# EAGLE design to_manufacturer_board (EAGLE 5.11)
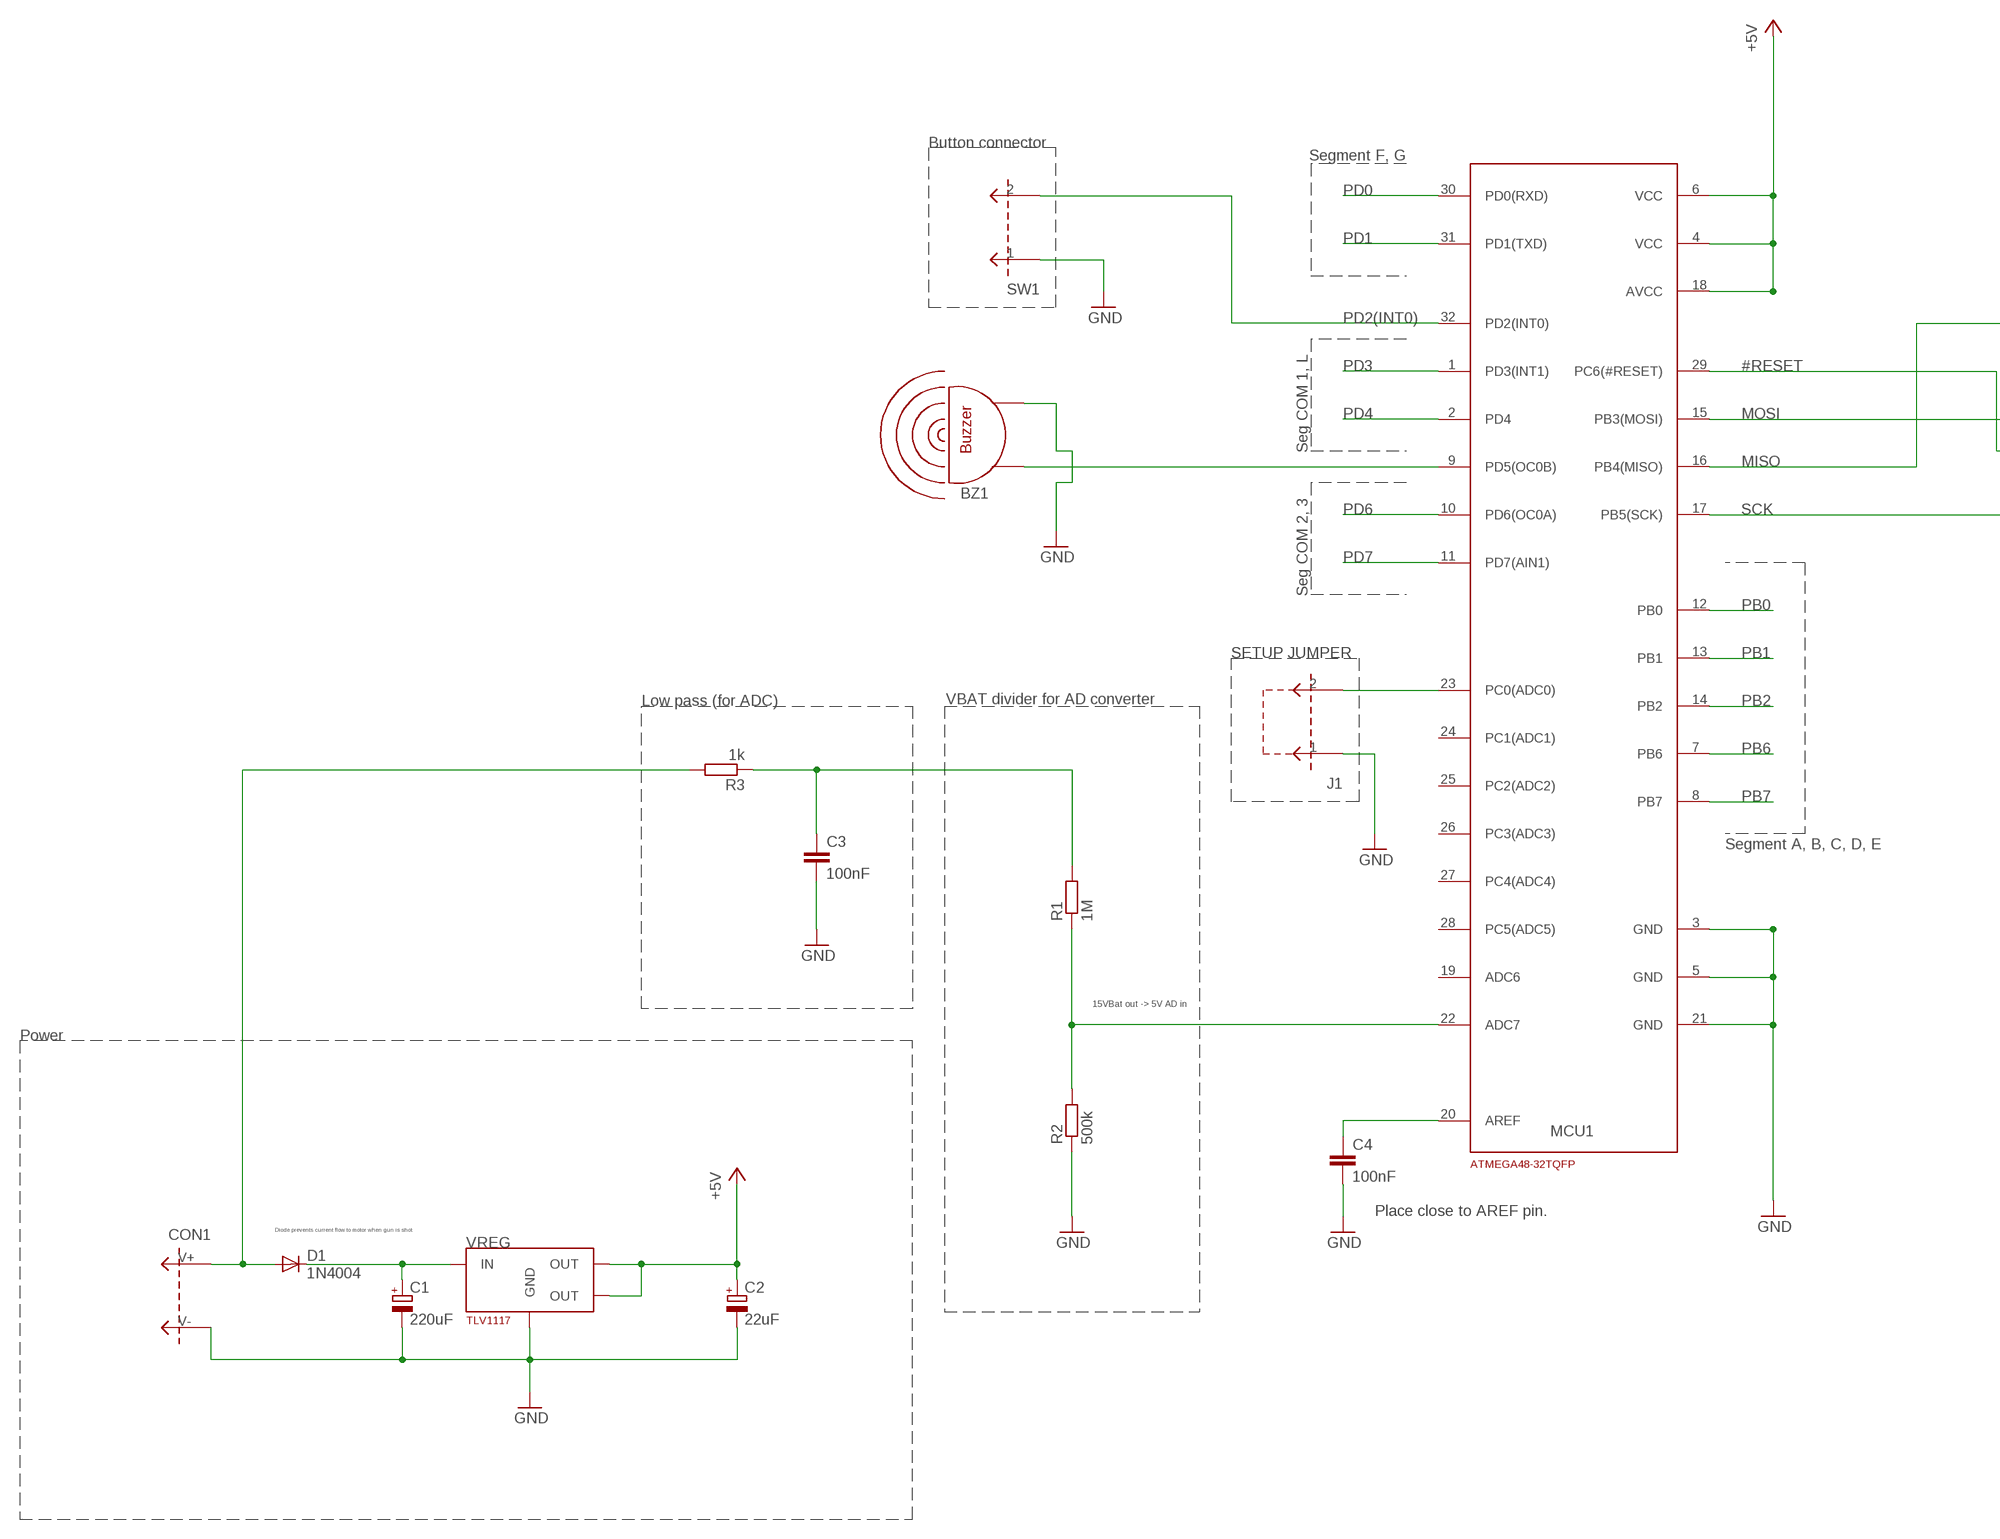
[diagram p0: schematic, sheet 1, part 1 of 2]
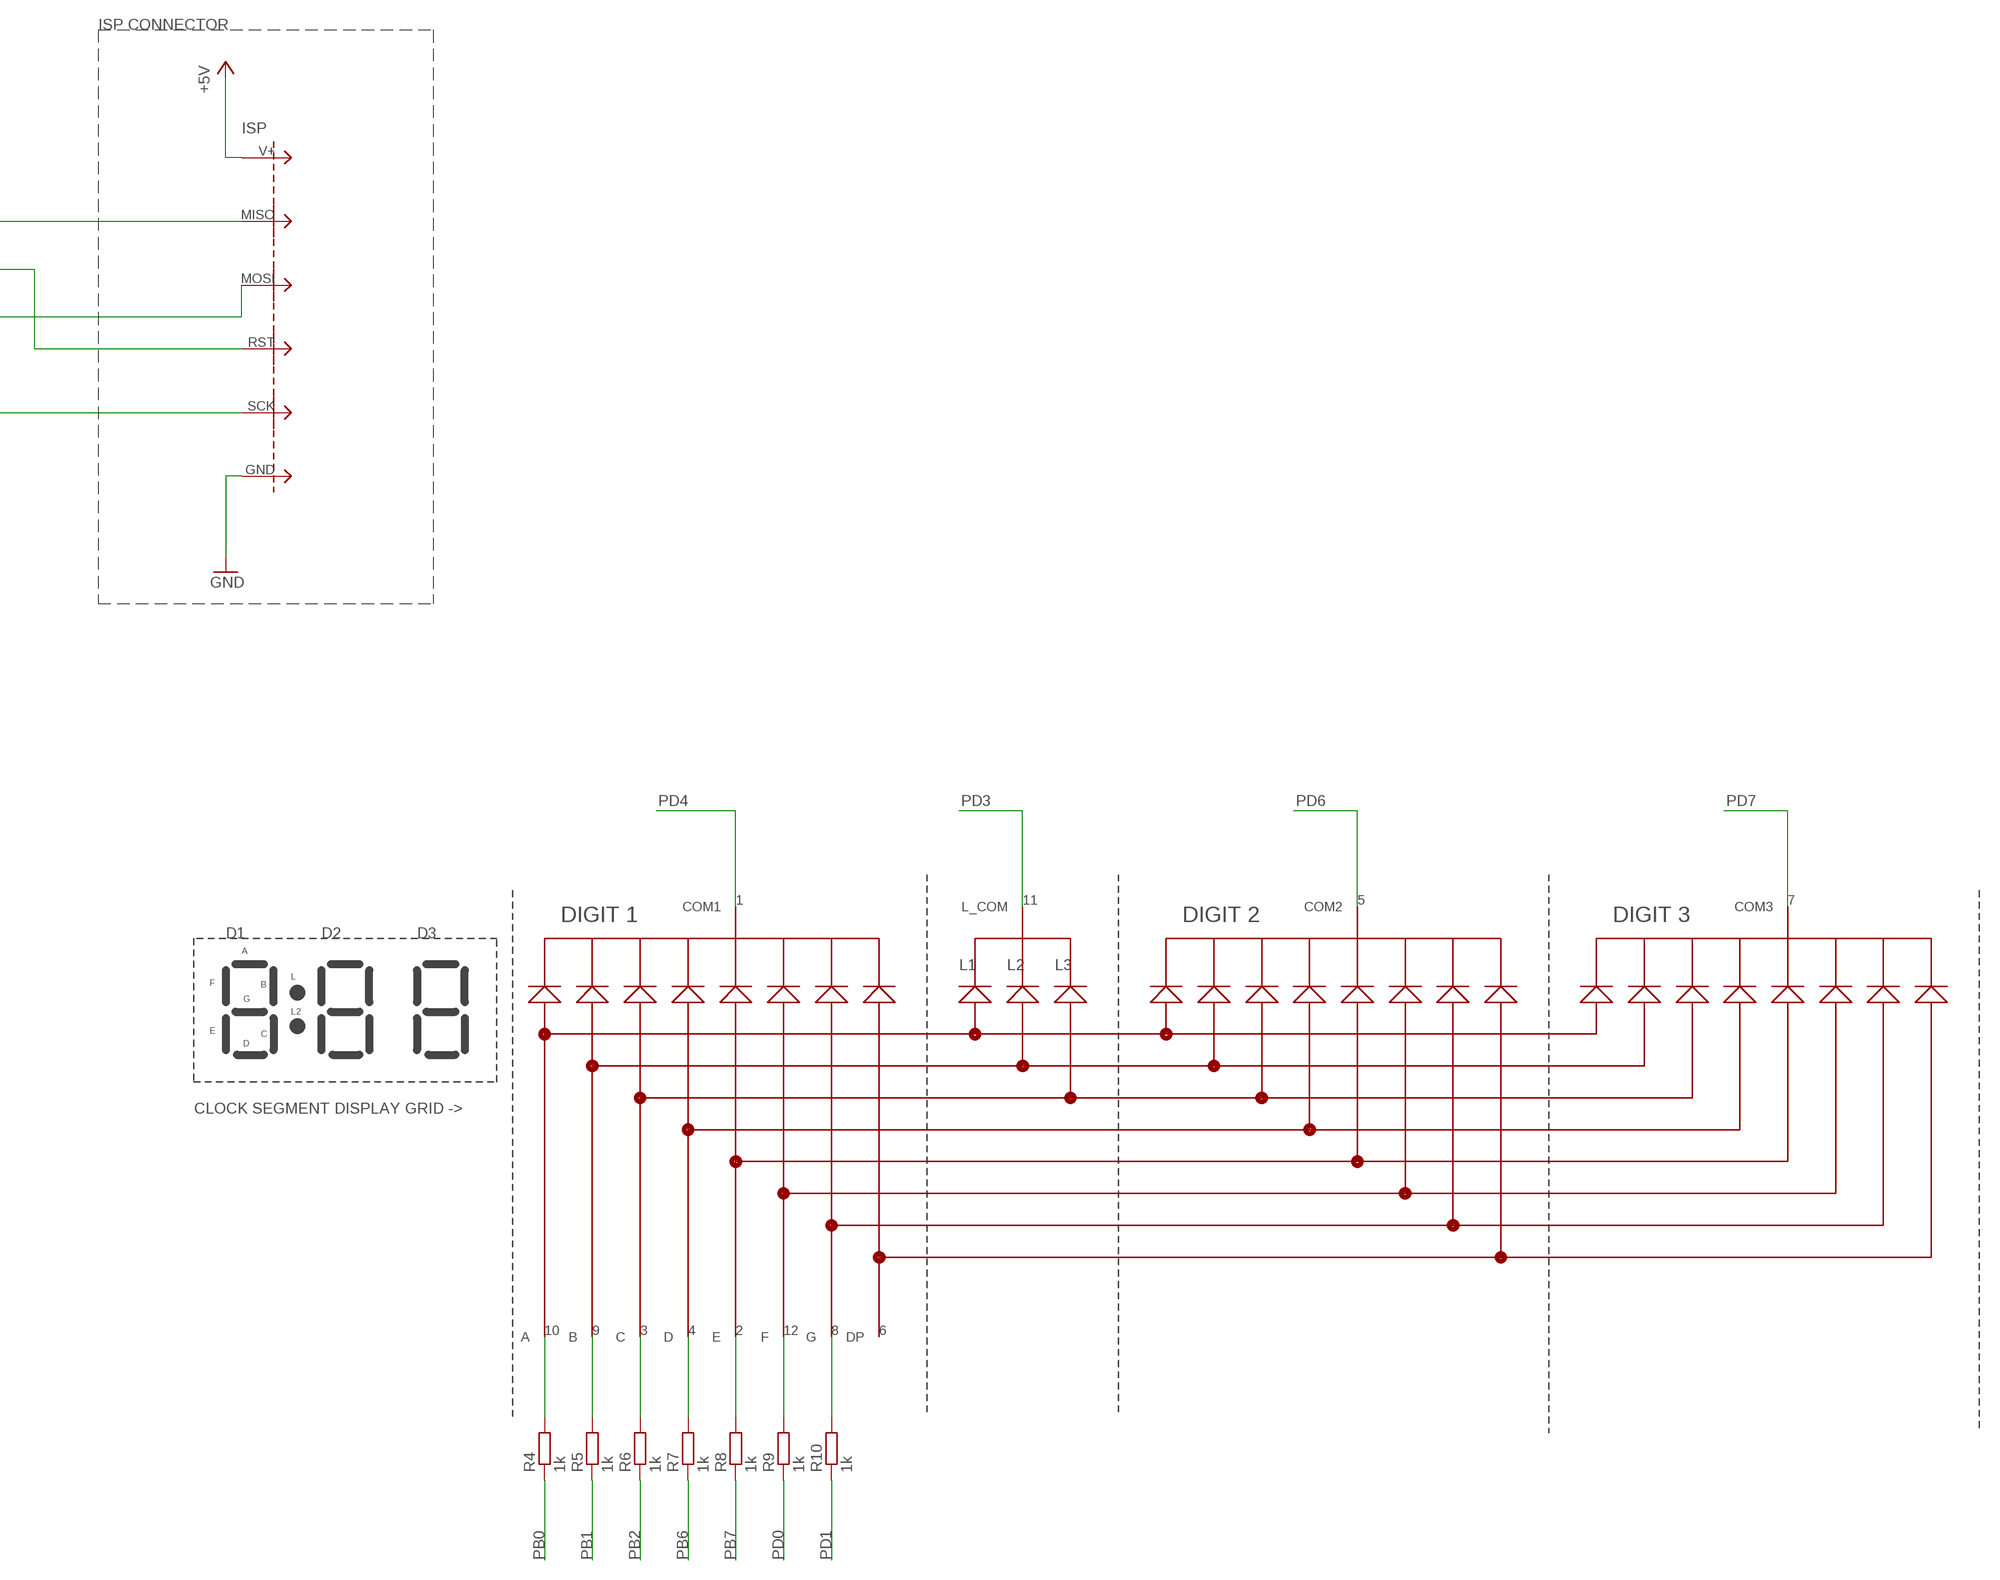
[diagram p1: schematic, sheet 1, part 2 of 2]

## Parts
BZ1  PS1720P02_BUZZER  [PS1720P02_BUZZER]
C1  220uF  CPOL-EUE3.5-8  [E3,5-8]
C2  22uF  CPOL-EUE1.5-5  [E1.5-5]
C3  100nF  C-EUC1206  [C1206]
C4  100nF  C-EUC1206  [C1206]
CON1  CONNECTOR_2PIN1X2_POWER_WIRE  [1X2_POWER_WIRE]
D1  1N4004  [DO41-10]
ISP  CONNECTOR_6PIN2X3_ISP  [2X3_ISP]
J1  CONNECTOR_2PIN1X2  [1X2_GENERIC]
MCU1  ATMEGA48-20PU-32TQFP  ATMEGA48-20PU-32TQFPTQFP32  [TQFP32-08]
R1  1M  R-EU_R0805  [R0805]
R2  500k  R-EU_R0805  [R0805]
R3  1k  R-EU_R0805  [R0805]
R4  1k  R-EU_R0805  [R0805]
R5  1k  R-EU_R0805  [R0805]
R6  1k  R-EU_R0805  [R0805]
R7  1k  R-EU_R0805  [R0805]
R8  1k  R-EU_R0805  [R0805]
R9  1k  R-EU_R0805  [R0805]
R10  1k  R-EU_R0805  [R0805]
SEGMENT1  SEGMENT_CLOCK_MODULE_3_DIGIT_COMMON_CATHODE  [SEGMENT_CLOCK_DISPLAY_HDSP_433G]
SW1  CONNECTOR_2PIN1X2  [1X2_GENERIC]
VREG  5VREG_TLV1117  [SOT223]

## Nets
#RESET: ISP.RST MCU1.29(PC6(#RESET))
+5V: C2.+ ISP.V+ MCU1.4(VCC) MCU1.6(VCC) MCU1.18(AVCC) VREG.2(OUT) VREG.4(OUT)
GND: BZ1.P$2 C1.- C2.- C3.2 C4.2 CON1.V- ISP.GND J1.1 MCU1.3(GND) MCU1.5(GND) MCU1.21(GND) R2.1 SW1.1 VREG.1(GND)
MISO: ISP.MISO MCU1.16(PB4(MISO))
MOSI: ISP.MOSI MCU1.15(PB3(MOSI))
N$1: C1.+ D1.C VREG.3(IN)
N$2: C4.1 MCU1.20(AREF)
N$3: J1.2 MCU1.23(PC0(ADC0))
N$5: MCU1.22(ADC7) R1.1 R2.2
N$6: C3.1 R1.2 R3.1
N$7: R4.2 SEGMENT1.10(A)
N$8: R5.2 SEGMENT1.9(B)
N$9: R6.2 SEGMENT1.3(C)
N$10: R7.2 SEGMENT1.4(D)
N$11: R8.2 SEGMENT1.2(E)
N$12: R9.2 SEGMENT1.12(F)
N$13: R10.2 SEGMENT1.8(G)
N$16: BZ1.P$1 MCU1.9(PD5(OC0B))
PB0: MCU1.12(PB0) R4.1
PB1: MCU1.13(PB1) R5.1
PB2: MCU1.14(PB2) R6.1
PB6: MCU1.7(PB6) R7.1
PB7: MCU1.8(PB7) R8.1
PD0: MCU1.30(PD0(RXD)) R9.1
PD1: MCU1.31(PD1(TXD)) R10.1
PD2(INT0): MCU1.32(PD2(INT0)) SW1.2
PD3: MCU1.1(PD3(INT1)) SEGMENT1.11(L_COM)
PD4: MCU1.2(PD4) SEGMENT1.1(COM1)
PD6: MCU1.10(PD6(OC0A)) SEGMENT1.5(COM2)
PD7: MCU1.11(PD7(AIN1)) SEGMENT1.7(COM3)
SCK: ISP.SCK MCU1.17(PB5(SCK))
V_GUNBATTERY: CON1.V+ D1.A R3.2
Unconnected: MCU1.19(ADC6) MCU1.24(PC1(ADC1)) MCU1.25(PC2(ADC2)) MCU1.26(PC3(ADC3)) MCU1.27(PC4(ADC4)) MCU1.28(PC5(ADC5)) SEGMENT1.6(DP)

## Notes on the sheet
- ISP CONNECTOR
- Button connector
- Segment F, G
- Seg COM 1, L
- Seg COM 2, 3
- SETUP JUMPER
- Low pass (for ADC) | VBAT divider for AD converter
- Segment A, B, C, D, E
- 15VBat out -> 5V AD in
- Power
- Place close to AREF pin.
- Diode prevents current flow to motor when gun is shot.

## Library data of the parts
BZ1 = project_specific_parts:PS1720P02_BUZZER
C1 C2 = RC_and_L:CPOL-EU: POLARIZED CAPACITOR, European symbol
C3 = RCL:C-EU: CAPACITOR, European symbol
C4 = RC_and_L:C-EU: CAPACITOR, European symbol
CON1 J1 SW1 = connectors:CONNECTOR_2PIN
D1 = project_specific_parts:1N4004: DIODE general purpose rectifier, 1 A
ISP = connectors:CONNECTOR_6PIN
MCU1 = project_specific_parts:ATMEGA48-20PU-32TQFP
R1-R10 = RC_and_L:R-EU_: RESISTOR, European symbol
SEGMENT1 = project_specific_parts:SEGMENT_CLOCK_MODULE_3_DIGIT_COMMON_CATHODE
VREG = project_specific_parts:5VREG_TLV1117

## Board
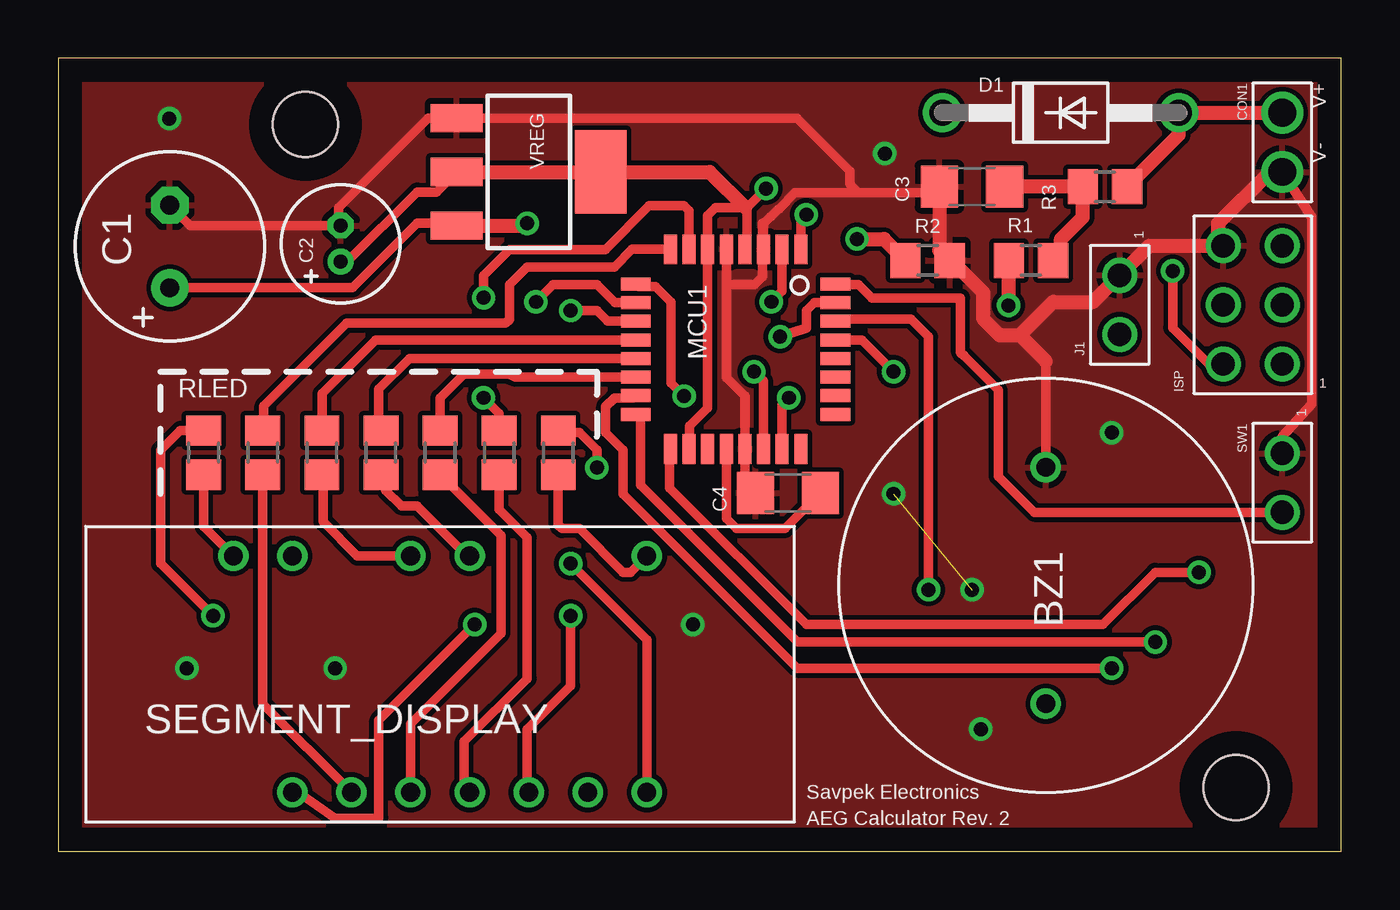
[diagram p2: board, top side]
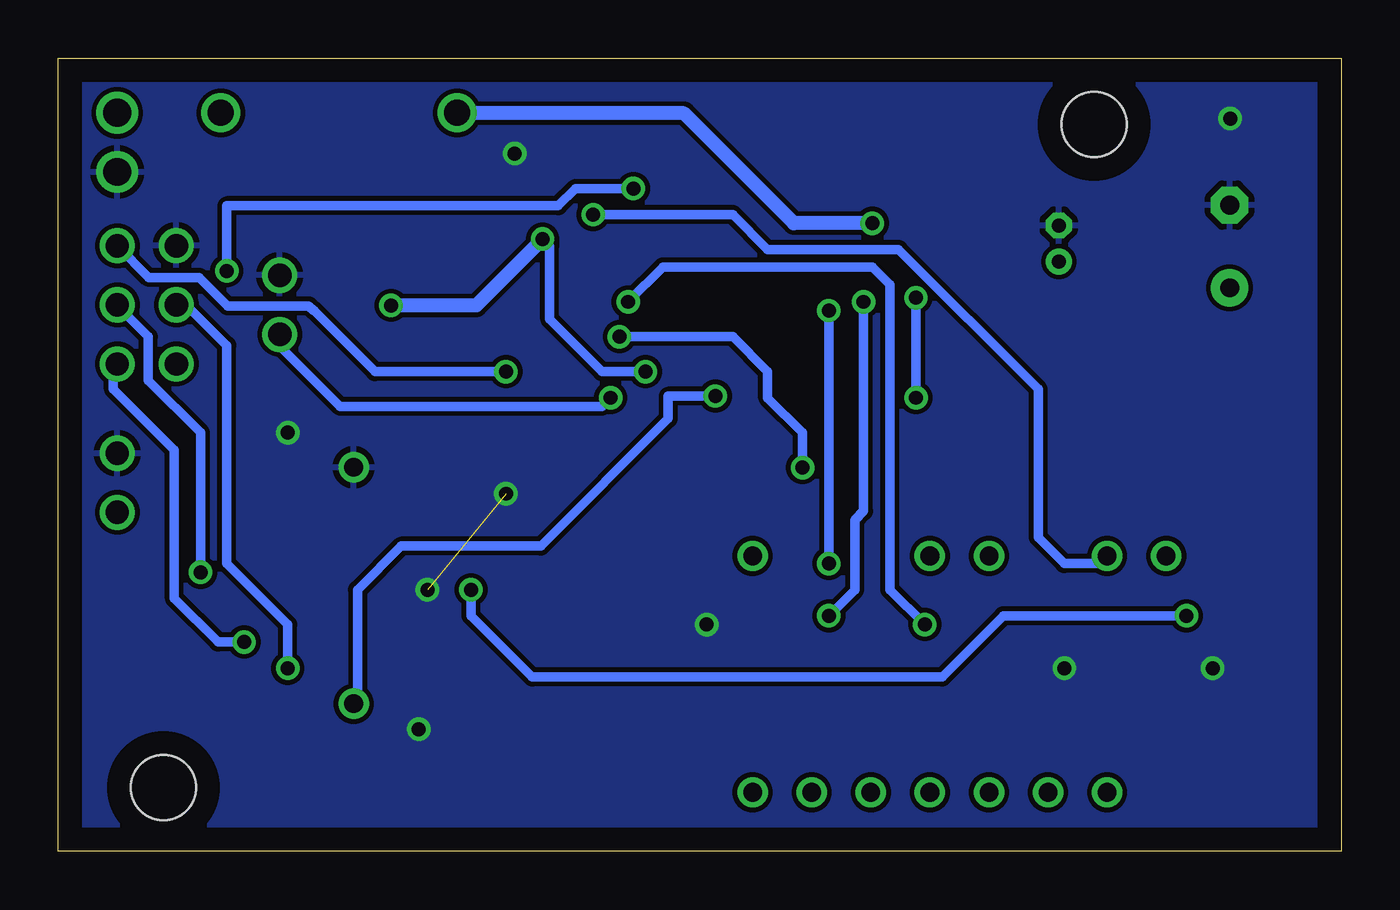
[diagram p3: board, bottom side, seen from below]

Size 55.15 x 34.1 mm. Coordinates in mm from the lower left corner, seen from the top.
Outline: 0,0 55.15,0 55.15,34.1 0,34.1 0,0
Copper layers (1*16): Top 0.035mm / dielectric 1.5mm / Bottom 0.035mm
Design rules "default *": minimum track width 10mil, minimum drill 0.6mm, track to track 8mil, track to pad 8mil, pad to pad 8mil, via to via 8mil, smd to smd 8mil, copper to edge 40mil, drill to drill 8mil, minimum pad ring 10mil, minimum via ring 8mil, stop-mask expansion 4mil, vias tented up to drill 0mil, thermal gap 10mil
Holes 2.8 mm at 50.63,2.75 10.63,31.25

### Footprints (pad centres in the part's own frame; a part is rotated, then mirrored left to right if it is on the bottom)
PS1720P02_BUZZER = drill 0.8 round: P$1 -5.08,0; P$2 5.08,0
E3,5-8 = drill 0.813 pad 1.6 round: + -1.778,0 | drill 0.813 pad 1.6 octagon: - 1.778,0
E1.5-5 = drill 0.6 round: + -0.77,0 | drill 0.6 octagon: - 0.79,0
C1206 = smd 1.6 x 1.8: 1 -1.4,0; 2 1.4,0
1X2_POWER_WIRE = drill 1.2 round: V+ -1.27,0; V- 1.27,0
DO41-10 = drill 1.118 round: A 5.08,0; C -5.08,0
2X3_ISP = drill 1 round: GND 1.27,-5.08; MISO -1.27,0; MOSI 1.27,-2.54; RST -1.27,-5.08; SCK -1.27,-2.54; V+ 1.27,0
1X2_GENERIC = drill 1 round: 1 0,0; 2 2.54,0
TQFP32-08 = smd 1.27 x 0.559: 1 -4.293,2.8; 2 -4.293,2; 3 -4.293,1.2; 4 -4.293,0.4; 5 -4.293,-0.4; 6 -4.293,-1.2; 7 -4.293,-2; 8 -4.293,-2.8; 17 4.293,-2.8; 18 4.293,-2; 19 4.293,-1.2; 20 4.293,-0.4; 21 4.293,0.4; 22 4.293,1.2; 23 4.293,2; 24 4.293,2.8 | smd 0.559 x 1.27: 9 -2.8,-4.293; 10 -2,-4.293; 11 -1.2,-4.293; 12 -0.4,-4.293; 13 0.4,-4.293; 14 1.2,-4.293; 15 2,-4.293; 16 2.8,-4.293; 25 2.8,4.293; 26 2,4.293; 27 1.2,4.293; 28 0.4,4.293; 29 -0.4,4.293; 30 -1.2,4.293; 31 -2,4.293; 32 -2.8,4.293
R0805 = smd 1.3 x 1.5: 1 -0.95,0; 2 0.95,0
SEGMENT_CLOCK_DISPLAY_HDSP_433G = drill 0.8 round: 1 0,-5.08; 2 2.54,-5.08; 3 5.08,-5.08; 4 7.62,-5.08; 5 10.16,-5.08; 6 12.7,-5.08; 7 15.24,-5.08; 8 15.24,5.08; 9 7.62,5.08; 10 5.08,5.08; 11 0,5.08; 12 -2.54,5.08
SOT223 = smd 1.219 x 2.235: 1 -2.311,-3.099; 2 0,-3.099; 3 2.311,-3.099 | smd 3.6 x 2.2: 4 0,3.099

### Placement (x,y rotation side)
BZ1  42.45,11.43 90 top
C1  4.8,26 90 top
C2  12.14,26.12 90 top
C3  39.27,28.57 180 top
C4  31.37,15.41 180 top
CON1  52.61,30.48 270 top
D1  43.09,31.75 0 top
ISP  51.34,20.95 180 top
J1  45.62,24.77 270 top
MCU1  29.12,21.59 270 top
R1  41.81,25.4 0 top
R2  37.37,25.4 180 top
R3  44.99,28.57 0 top
R4  11.33,17.14 270 top
R5  13.88,17.14 270 top
R6  16.42,17.14 270 top
R7  18.96,17.14 270 top
R8  8.79,17.14 270 top
R9  6.25,17.14 270 top
R10  21.5,17.14 270 top
SEGMENT1  10.06,7.62 0 top
SW1  52.61,17.11 270 top
VREG  20.23,29.21 270 top

### Tracks (layer width: path | path; a pad name or v marks a point on that pad's centre or on a via)
#RESET  (via drill 0.6)
  Top 0.406: MCU1.29 34.54,21.99 v35.91,20.62
  Bottom 0.406: v35.91,20.62 41.53,20.62 44.16,23.25 44.18,23.25 44.38,23.45 47.87,23.45 49.09,24.68 51.25,24.68 ISP.RST
+5V  (via drill 0.6)
  Top 0.406: MCU1.18 27.14,17.32 27.14,18.29 27.92,19.06 MCU1.6 27.92,27.34 28.26,27.68 29.53,27.68 29.61,27.68 | 29.61,27.68 29.61,25.97 MCU1.4 | C2.+ 12.43,25.35 15.43,28.35 16.27,28.35 VREG.2 | ISP.V+ 49.45,20.95 47.91,22.5 v47.9,24.95 | v30.43,28.5 29.61,27.68
  Top 0.61: VREG.2 VREG.4 28,29.21 29.53,27.68
  Bottom 0.406: v47.9,24.95 47.91,27.75 33.66,27.75 32.91,28.5 v30.43,28.5
GND  (via drill 0.6)  (1 unrouted)
  Top 0.406: 37.88,25.84 R2.1 | 30.28,25.92 30.28,27 | 30.28,25.92 MCU1.3 30.32,26.98 30.61,27.28 30.63,27.28 30.96,27.61 30.98,27.61 31.68,28.31 34.41,28.31 | C1.- 5.67,26.91 C2.- 12.05,27 12.05,27.68 15.9,31.52 VREG.1 31.76,31.52 34.03,29.25 34.03,28.69 34.41,28.31 | 28.71,24.33 28.71,20.38 29.51,19.58 MCU1.21 29.52,15.86 C4.2 30.56,15.75 | 28.71,24.33 MCU1.5 | 30.28,25.92 30.28,24.71 29.94,24.37 28.76,24.37 28.71,24.33 | 42.45,21.08 BZ1.P$2 | SW1.1 52.61,17.83 53.88,19.23 53.88,27.27 CON1.V- | 34.41,28.31 37.61,28.31 C3.2
  Top 0.61: C3.2 37.88,25.84 | CON1.V- 52.06,29.21 49.86,27 49.86,26.25 ISP.GND 46.9,26.04 J1.1 44.48,23.62 42.76,23.62 41.33,22.2 | R2.1 38.39,25.4 39.75,24.04 39.75,22.91 40.46,22.2 41.33,22.2 | 41.33,22.2 42.45,21.08
  other vias: 4.78,31.5 5.53,7.88 39.66,5.25 45.28,18 27.28,9.75 35.53,30 35.91,15.38 11.9,7.88 39.28,11.25
  pour Top: -1.97,35.25 -1.97,-1.5 56.91,-1.5 56.91,34.88 -1.22,34.88 -1.22,35.25
  pour Bottom: -1.97,36 -1.97,-2.25 57.28,-2.25 57.28,-1.88 56.91,-1.88 56.91,34.88 56.91,35.62 -0.84,35.62 -0.84,36
MISO  (via drill 0.6)
  Top 0.406: MCU1.16 25.03,18.58 25.03,15.75 31.78,9 v47.16,9
  Bottom 0.406: 52.61,20.83 ISP.MISO 52.78,20.79 52.78,19.88 50.16,17.25 50.16,10.88 48.28,9 v47.16,9
MOSI  (via drill 0.6)
  Top 0.406: v45.28,7.88 31.78,7.88 24.28,15.38 24.28,17.25 23.53,18 23.53,19.12 23.91,19.5 24.73,19.5 MCU1.15
  Bottom 0.406: ISP.MOSI 49.65,23.5 47.91,21.75 47.91,12.38 45.28,9.75 v45.28,7.88
N$1  (via drill 0.6)
  Top 0.406: C1.+ 12.66,24.23 15.43,27 17.03,27 VREG.3
  Top 0.61: VREG.3 20.05,26.9 v20.16,27
  Bottom 0.61: v20.16,27 23.53,27 28.26,31.73 37.98,31.73 D1.C
N$2
  Top 0.406: MCU1.20 28.71,14.31 29.16,13.88 31.23,13.88 C4.1
N$3  (via drill 0.6)
  Top 0.406: MCU1.23 31.12,19.21 v31.41,19.5
  Bottom 0.406: J1.2 45.66,22.2 45.66,21.75 43.03,19.12 31.78,19.12 v31.41,19.5
N$5  (via drill 0.6)
  Top 0.406: MCU1.22 30.32,20.21 v29.91,20.62
  Top 0.61: R1.1 40.87,23.49 v40.85,23.47 | v34.33,26.32 35.5,26.32 R2.2
  Bottom 0.406: v29.91,20.62 31.78,20.62 34.03,22.88 34.03,26.02 v34.33,26.32
  Bottom 0.61: v40.85,23.47 37.18,23.47 v34.33,26.32
N$6
  Top 0.61: R1.2 43.11,25.74 43.11,26.32 44.04,27.26 R3.1 C3.1
N$7
  Top 0.406: SEGMENT1.10 12.85,12.7 11.38,14.18 11.38,16.15 R4.2
N$8
  Top 0.406: SEGMENT1.9 17.58,12.7 15.43,14.85 14.75,14.85 14.08,15.53 14.08,15.99 R5.2
N$9
  Top 0.406: SEGMENT1.3 15.14,5.49 19.03,9.38 19.03,13.58 R6.2
N$10
  Top 0.406: R7.2 18.96,14.7 20.16,13.5 20.16,7.42 17.46,4.72 17.46,2.77 SEGMENT1.4
N$11
  Top 0.406: R8.2 8.79,6.35 SEGMENT1.2
N$12
  Top 0.406: R9.2 6.25,13.97 SEGMENT1.12
N$13
  Top 0.406: R10.2 21.5,14.04 21.66,13.88 22.41,13.88 24.28,12 24.61,12 SEGMENT1.8
N$16  (via drill 0.6)
  Top 0.406: v26.91,19.57 26.35,20.13 26.35,23.61 25.68,24.28 24.94,24.28 MCU1.9
  Bottom 0.406: v26.91,19.57 28.93,19.57 28.93,18.6 34.41,13.12 40.41,13.12 42.28,11.25 42.28,6.52 BZ1.P$1 42.18,6.08
PB0
  Top 0.406: R4.1 11.33,19.68 13.64,21.99 MCU1.12
PB1
  Top 0.406: 13.95,18.09 R5.1 13.78,18.19 13.78,19.88 15.1,21.2 MCU1.13
PB2
  Top 0.406: R6.1 16.41,18.11 16.41,19.5 17.44,20.52 19.32,20.52 19.64,20.39 MCU1.14
PB6  (via drill 0.6)
  Top 0.406: R7.1 18.96,18.82 v18.28,19.5 | v18.28,23.8 18.28,24.75 19.41,25.88 23.53,25.88 25.41,27.75 26.91,27.75 27.12,27.54 MCU1.7
  Bottom 0.406: v18.28,19.5 v18.28,23.8
PB7
  Top 0.406: 8.68,18.21 R8.1 8.83,18.13 8.83,19.14 12.4,22.7 19.24,22.7 19.41,22.87 19.41,24.38 20.16,25.12 23.91,25.12 24.66,25.88 MCU1.8
PD0  (via drill 0.6)
  Top 0.406: R9.1 5.25,18.09 4.41,17.25 4.41,12.38 v6.66,10.12 | v37.41,11.25 37.41,22.12 36.66,22.88 33.49,22.88 MCU1.30
  Bottom 0.406: v6.66,10.12 14.53,10.12 17.16,7.5 34.78,7.5 37.41,10.12 v37.41,11.25
PD1  (via drill 0.6)
  Top 0.406: MCU1.31 32.5,23.59 32.16,23.25 32.16,22.5 v31.03,22.12 | v23.16,16.5 23.16,17.25 22.41,18 21.59,18 R10.1
  Bottom 0.406: v31.03,22.12 26.16,22.12 24.66,20.62 24.66,19.5 23.16,18 v23.16,16.5
PD2(INT0)
  Top 0.406: 33.5,24.3 MCU1.32 33.42,24.38 34.41,24.38 34.98,23.8 38.78,23.8 38.78,21.45 38.94,21.29 | 38.94,21.29 38.94,21.3 | 38.94,21.29 40.4,19.83 40.4,18.9 40.41,18.9 40.41,16.12 41.95,14.57 SW1.2
PD3  (via drill 0.6)
  Top 0.406: MCU1.1 31.91,27.14 v32.16,27.38
  Bottom 0.406: v32.16,27.38 26.16,27.38 24.66,25.88 19.03,25.88 13.03,19.88 13.03,13.5 11.9,12.38 10.39,12.38 SEGMENT1.11
PD4  (via drill 0.6)
  Top 0.406: v17.91,9.75 13.78,5.62 13.78,1.42 11.9,1.42 10.31,2.54 SEGMENT1.1 | MCU1.2 31.12,24.09 v30.66,23.62
  Bottom 0.406: v17.91,9.75 19.41,11.25 19.41,24.38 20.16,25.12 29.16,25.12 v30.66,23.62
PD6  (via drill 0.6)
  Top 0.406: MCU1.10 23.94,23.59 23.16,24.38 21.28,24.38 v20.53,23.62 | v22.03,10.12 22.03,7.12 20.16,5.25 20.16,2.61 SEGMENT1.5
  Bottom 0.406: v20.53,23.62 20.53,14.62 20.91,14.25 20.91,11.25 v22.03,10.12
PD7  (via drill 0.6)
  Top 0.406: SEGMENT1.7 25.3,9.1 v22.03,12.38 | MCU1.11 23.62,22.79 23.16,23.25 v22.03,23.25
  Bottom 0.406: v22.03,12.38 22.03,22.88 v22.03,23.25
SCK  (via drill 0.6)
  Top 0.406: MCU1.17 26.27,17.25 26.27,15.63 32.16,9.75 44.91,9.75 47.16,12 v49.03,12
  Bottom 0.406: ISP.SCK 52.61,23.45 51.28,22.12 51.28,20.25 49.03,18 v49.03,12
V_GUNBATTERY
  Top 0.61: CON1.V+ D1.A 48.16,30.8 R3.2

### Text on the board
tPlace: Savpek Electronics | AEG Calculator Rev. 2
tNames: RLED